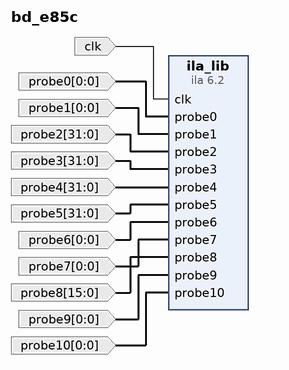
[diagram p0: block diagram of the top level]
# Vivado block design bd_e85c, xc7z020clg484-1, Vivado 2020.1
create_bd_design bd_e85c

create_bd_port -dir I -type clk clk
create_bd_port -dir I -from 0 -to 0 probe0
create_bd_port -dir I -from 0 -to 0 probe1
create_bd_port -dir I -from 31 -to 0 probe2
create_bd_port -dir I -from 31 -to 0 probe3
create_bd_port -dir I -from 31 -to 0 probe4
create_bd_port -dir I -from 31 -to 0 probe5
create_bd_port -dir I -from 0 -to 0 probe6
create_bd_port -dir I -from 0 -to 0 probe7
create_bd_port -dir I -from 15 -to 0 probe8
create_bd_port -dir I -from 0 -to 0 probe9
create_bd_port -dir I -from 0 -to 0 probe10

create_bd_cell -type ip -vlnv xilinx.com:ip:ila:6.2 ila_lib
set_property -dict [list \
  CONFIG.ALL_PROBE_SAME_MU TRUE \
  CONFIG.ALL_PROBE_SAME_MU_CNT 1 \
  CONFIG.C_ADV_TRIGGER FALSE \
  CONFIG.C_DATA_DEPTH 1024 \
  CONFIG.C_EN_STRG_QUAL 0 \
  CONFIG.C_EN_TIME_TAG 0 \
  CONFIG.C_ILA_CLK_FREQ 100000000 \
  CONFIG.C_INPUT_PIPE_STAGES 0 \
  CONFIG.C_MONITOR_TYPE Native \
  CONFIG.C_NUM_OF_PROBES 11 \
  CONFIG.C_PROBE0_MU_CNT 1 \
  CONFIG.C_PROBE0_TYPE 0 \
  CONFIG.C_PROBE0_WIDTH 1 \
  CONFIG.C_PROBE10_MU_CNT 1 \
  CONFIG.C_PROBE10_TYPE 0 \
  CONFIG.C_PROBE10_WIDTH 1 \
  CONFIG.C_PROBE1_MU_CNT 1 \
  CONFIG.C_PROBE1_TYPE 0 \
  CONFIG.C_PROBE1_WIDTH 1 \
  CONFIG.C_PROBE2_MU_CNT 1 \
  CONFIG.C_PROBE2_TYPE 0 \
  CONFIG.C_PROBE2_WIDTH 32 \
  CONFIG.C_PROBE3_MU_CNT 1 \
  CONFIG.C_PROBE3_TYPE 0 \
  CONFIG.C_PROBE3_WIDTH 32 \
  CONFIG.C_PROBE4_MU_CNT 1 \
  CONFIG.C_PROBE4_TYPE 0 \
  CONFIG.C_PROBE4_WIDTH 32 \
  CONFIG.C_PROBE5_MU_CNT 1 \
  CONFIG.C_PROBE5_TYPE 0 \
  CONFIG.C_PROBE5_WIDTH 32 \
  CONFIG.C_PROBE6_MU_CNT 1 \
  CONFIG.C_PROBE6_TYPE 0 \
  CONFIG.C_PROBE6_WIDTH 1 \
  CONFIG.C_PROBE7_MU_CNT 1 \
  CONFIG.C_PROBE7_TYPE 0 \
  CONFIG.C_PROBE7_WIDTH 1 \
  CONFIG.C_PROBE8_MU_CNT 1 \
  CONFIG.C_PROBE8_TYPE 0 \
  CONFIG.C_PROBE8_WIDTH 16 \
  CONFIG.C_PROBE9_MU_CNT 1 \
  CONFIG.C_PROBE9_TYPE 0 \
  CONFIG.C_PROBE9_WIDTH 1 \
  CONFIG.C_TIME_TAG_WIDTH 32 \
  CONFIG.C_TRIGIN_EN false \
  CONFIG.C_TRIGOUT_EN false \
  CONFIG.C_XLNX_HW_PROBE_INFO DEFAULT \
] [get_bd_cells ila_lib]

# ---- connections ----

connect_bd_net [get_bd_ports clk] [get_bd_pins ila_lib/clk]
connect_bd_net -net probe0_1 [get_bd_ports probe0] [get_bd_pins ila_lib/probe0]
connect_bd_net -net probe1_1 [get_bd_ports probe1] [get_bd_pins ila_lib/probe1]
connect_bd_net -net probe2_1 [get_bd_ports probe2] [get_bd_pins ila_lib/probe2]
connect_bd_net -net probe3_1 [get_bd_ports probe3] [get_bd_pins ila_lib/probe3]
connect_bd_net -net probe4_1 [get_bd_ports probe4] [get_bd_pins ila_lib/probe4]
connect_bd_net -net probe5_1 [get_bd_ports probe5] [get_bd_pins ila_lib/probe5]
connect_bd_net -net probe6_1 [get_bd_ports probe6] [get_bd_pins ila_lib/probe6]
connect_bd_net -net probe7_1 [get_bd_ports probe7] [get_bd_pins ila_lib/probe7]
connect_bd_net -net probe8_1 [get_bd_ports probe8] [get_bd_pins ila_lib/probe8]
connect_bd_net -net probe9_1 [get_bd_ports probe9] [get_bd_pins ila_lib/probe9]
connect_bd_net -net probe10_1 [get_bd_ports probe10] [get_bd_pins ila_lib/probe10]

validate_bd_design
save_bd_design
